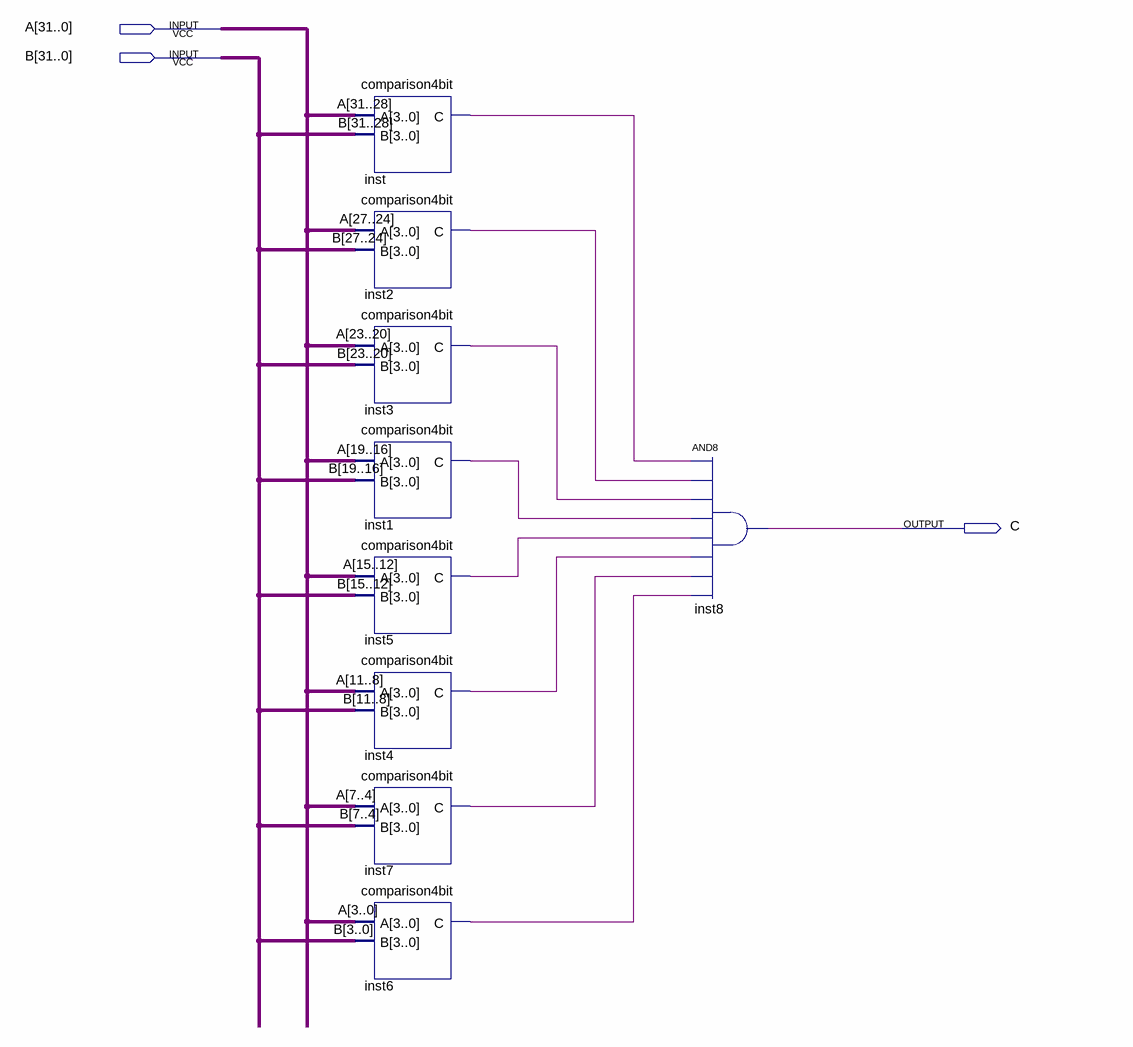
[diagram p0: schematic sheet]
// Quartus schematic comparison32bit.bdf as structural Verilog: 9 symbols, 3 pins
module comparison32bit (
  input  [31:0] A,
  input  [31:0] B,
  output C
);

  wire inst1_c, inst2_c, inst3_c, inst4_c, inst5_c, inst6_c, inst7_c, inst_c;

  comparison4bit inst (.A(A[31:28]), .B(B[31:28]), .C(inst_c));
  comparison4bit inst2 (.A(A[27:24]), .B(B[27:24]), .C(inst2_c));
  comparison4bit inst3 (.A(A[23:20]), .B(B[23:20]), .C(inst3_c));
  comparison4bit inst1 (.A(A[19:16]), .B(B[19:16]), .C(inst1_c));
  comparison4bit inst5 (.A(A[15:12]), .B(B[15:12]), .C(inst5_c));
  comparison4bit inst4 (.A(A[11:8]), .B(B[11:8]), .C(inst4_c));
  comparison4bit inst7 (.A(A[7:4]), .B(B[7:4]), .C(inst7_c));
  comparison4bit inst6 (.A(A[3:0]), .B(B[3:0]), .C(inst6_c));
  and inst8 (C, inst_c, inst2_c, inst3_c, inst1_c, inst5_c, inst4_c, inst7_c, inst6_c);
endmodule
